# EAGLE design Euro5VDCDC (EAGLE 9.0.1)
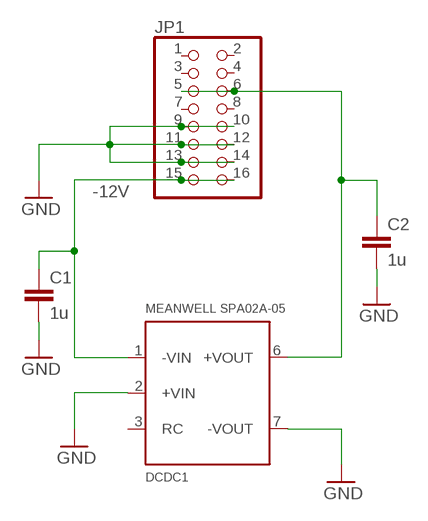
[diagram p0: schematic, sheet 1]

## Parts
C1  1u  C-EUC1206K  [C1206K]
C2  1u  C-EUC1206K  [C1206K]
DCDC1  MEANWELL SPA02A-05  MEANWELL_SPA02  [MEANWELL_SPA02]
JP1  PINHD-2X8  [2X08]

## Nets
-12V: C1.1 DCDC1.1(-VIN) JP1.15 JP1.16
GND: C1.2 C2.2 DCDC1.2(+VIN) DCDC1.7(-VOUT) JP1.9 JP1.10 JP1.11 JP1.12 JP1.13 JP1.14
N$2: C2.1 DCDC1.6(+VOUT) JP1.5 JP1.6
Unconnected: DCDC1.3(RC) JP1.1 JP1.2 JP1.3 JP1.4 JP1.7 JP1.8

## Library data of the parts
C1 C2 = rcl:C-EU: CAPACITOR, European symbol; SPICEPREFIX: C
DCDC1 = L71_devices:MEANWELL_SPA02: Mean Well DC-DC converter SPA02 series
JP1 = pinhead:PINHD-2X8: PIN HEADER

## Board
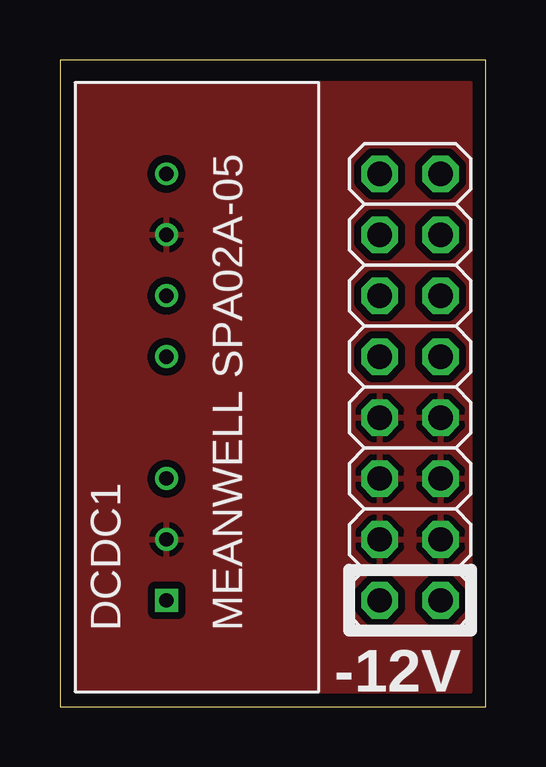
[diagram p1: board, top side]
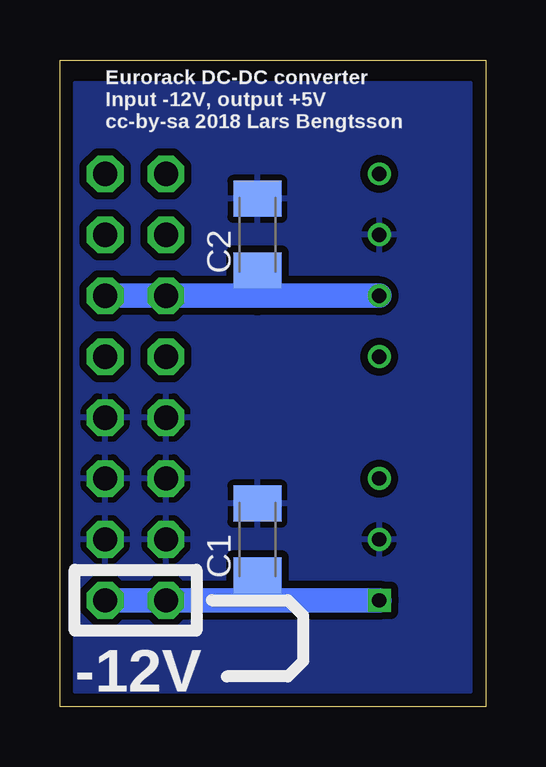
[diagram p2: board, bottom side, seen from below]

Size 17.76 x 26.97 mm. Coordinates in mm from the lower left corner, seen from the top.
Outline: 0,0 17.76,0 17.76,26.97 0,26.97 0,0
Copper layers (1*16): Top 0.0356mm / dielectric 1.5011mm / Bottom 0.0356mm
Design rules "Laen OSH Park PCBOrder": minimum track width 6mil, minimum drill 13mil, track to track 6mil, track to pad 6mil, pad to pad 6mil, via to via 6mil, smd to smd 6mil, copper to edge 15mil, drill to drill 6mil, minimum pad ring 7mil, minimum via ring 7mil, stop-mask expansion 3mil, vias tented up to drill 0mil, thermal gap 10mil

### Footprints (pad centres in the part's own frame; a part is rotated, then mirrored left to right if it is on the bottom)
C1206K = smd 1.5 x 2: 1 -1.5,0; 2 1.5,0
MEANWELL_SPA02 = drill 0.6 square: 1 -8.89,0 | drill 0.6: 2 -6.35,0; 3 -3.81,0; 5 1.27,0; 6 3.81,0; 7 6.35,0; 8 8.89,0
2X08 = drill 1.016 octagon: 1 -8.89,-1.27; 2 -8.89,1.27; 3 -6.35,-1.27; 4 -6.35,1.27; 5 -3.81,-1.27; 6 -3.81,1.27; 7 -1.27,-1.27; 8 -1.27,1.27; 9 1.27,-1.27; 10 1.27,1.27; 11 3.81,-1.27; 12 3.81,1.27; 13 6.35,-1.27; 14 6.35,1.27; 15 8.89,-1.27; 16 8.89,1.27

### Placement (x,y rotation side)
C1  9.53,6.99 90 bottom
C2  9.53,19.68 90 bottom
DCDC1  4.44,13.34 90 top
JP1  14.61,13.34 270 top

### Tracks (layer width: path | path; a pad name or v marks a point on that pad's centre or on a via)
-12V
  Bottom 1.016: DCDC1.1 9.53,4.44 | 9.53,4.44 JP1.15 JP1.16 | C1.1 9.53,4.44
GND
  pour Bottom (isolate 0.305): 0.63,26.04 17.14,26.04 17.14,0.64 0.63,0.64
  pour Top (isolate 0.305): 0.63,26.04 17.14,26.04 17.14,0.64 0.63,0.64
N$2
  Bottom 1.016: DCDC1.6 9.53,17.14 | 9.53,17.14 JP1.5 JP1.6 | C2.1 9.53,17.14

### Text on the board
tPlace: -12V
bPlace: Eurorack DC-DC converter / Input -12V, output +5V / cc-by-sa 2018 Lars Bengtsson | -12V